# EAGLE design flute (EAGLE 6.1)
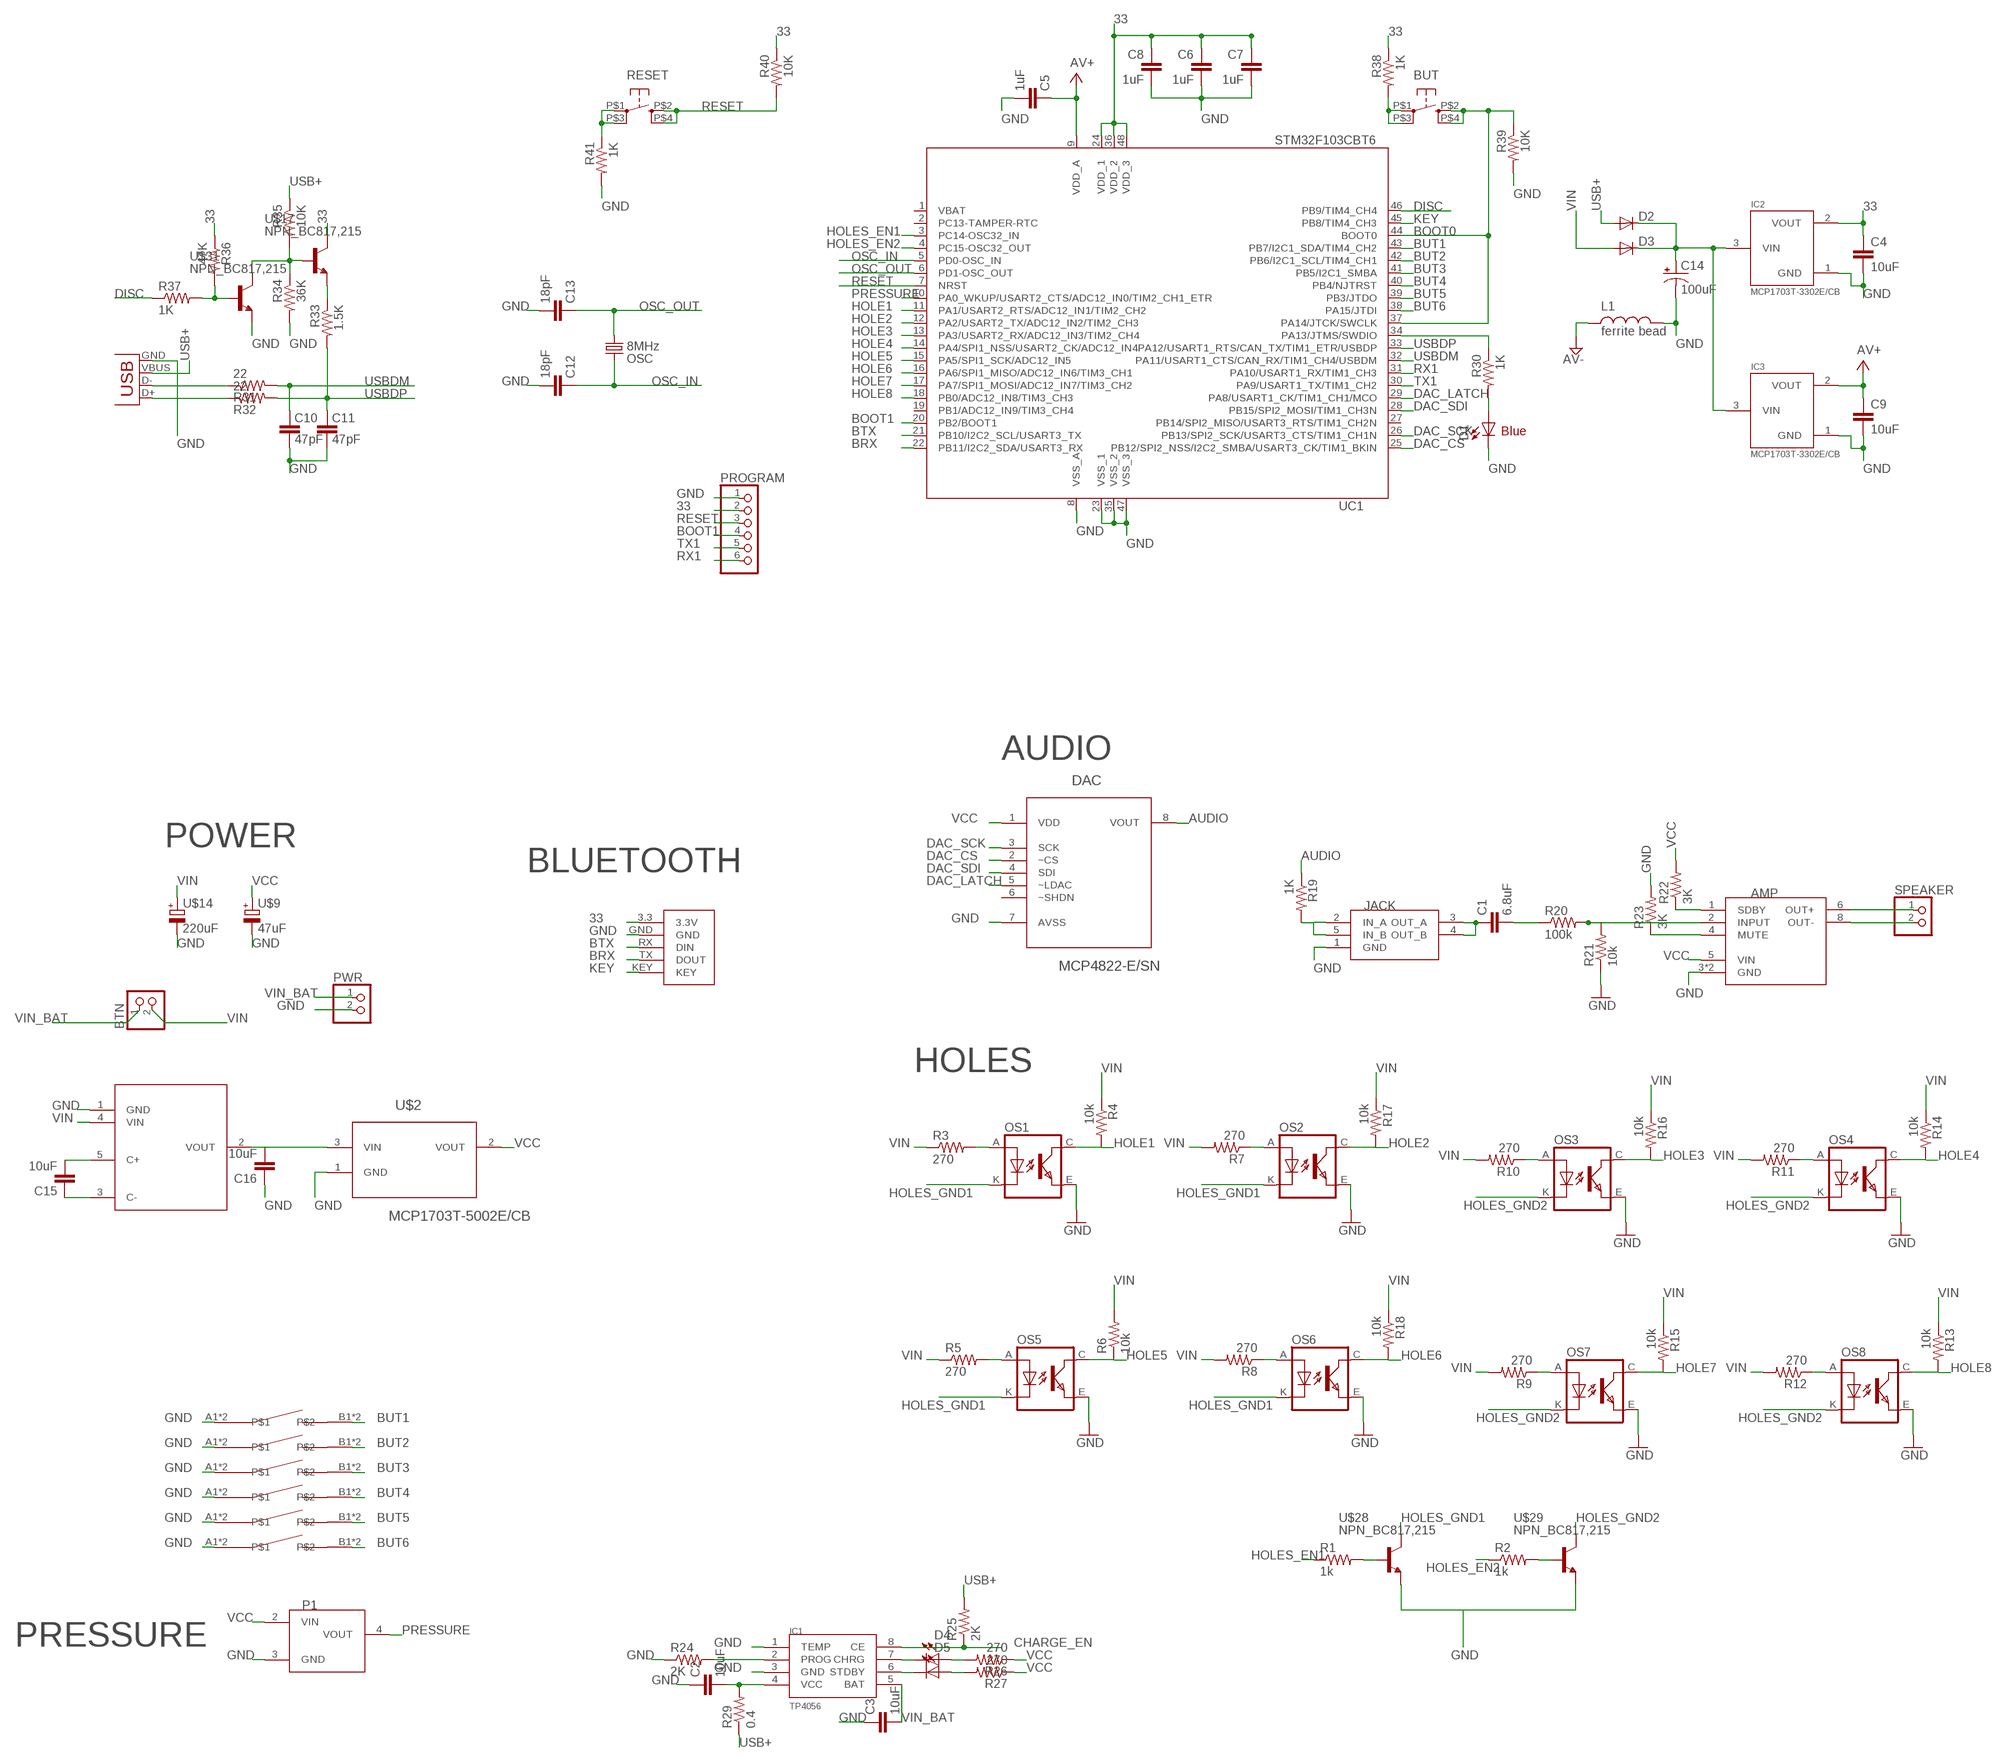
[diagram p0: schematic, sheet 1]

## Parts
AMP  AN7511DIP8  [DIL08]
BTN  CONNEC_1X02BASIC  [CONNEC_1X02]
BUT  KMR211GLFS  BUTTON-KMR241GLFS  [PUSHBUTTON-KMR241GLFS]
C1  6.8uF  CAP0805  [0805]
C2  10uF  CAP0805  [0805]
C3  10uF  CAP0805  [0805]
C4  10uF  CAP0805  [0805]
C5  1uF  CAP0402  [C0402]
C6  1uF  CAP0402  [C0402]
C7  1uF  CAP0402  [C0402]
C8  1uF  CAP0402  [C0402]
C9  10uF  CAP0805  [0805]
C10  47pF  CAP0402  [C0402]
C11  47pF  CAP0402  [C0402]
C12  18pF  CAP0402  [C0402]
C13  18pF  CAP0402  [C0402]
C14  100uF  CAP_POL1206  [EIA3216]
C15  10uF  CAP0805  [0805]
C16  10uF  CAP0805  [0805]
D1  Blue  LED1206  [LED-1206]
D2  DIODESOD  [SOD-323]
D3  DIODESOD  [SOD-323]
D4  Red  LED1206  [LED-1206]
D5  Green  LED1206  [LED-1206]
DAC  MCP4822-E/SN  [SOIC8-N_MC]
IC1  TP4056  [SOP-8]
IC2  MCP1703T-3302E/CB  MCP1700T  [SOT23]
IC3  MCP1703T-3302E/CB  MCP1700T  [SOT23]
JACK  JACK  [3F07]
L1  ferrite bead  INDUCTOR0603  [0603]
OS1  TCRT5000  [TCRT5000]
OS2  TCRT5000  [TCRT5000]
OS3  TCRT5000  [TCRT5000]
OS4  TCRT5000  [TCRT5000]
OS5  TCRT5000  [TCRT5000]
OS6  TCRT5000  [TCRT5000]
OS7  TCRT5000  [TCRT5000]
OS8  TCRT5000  [TCRT5000]
OSC  8MHz  CRYSTAL5X3  [CRYSTAL-SMD-5X3]
P1  PRESSURE_SENSOR  [MPXV5050GP]
PROGRAM  CONNEC_1X066PADS  [6PADS]
PWR  CONNEC_1X02BASIC  [CONNEC_1X02]
R1  1k  RESISTOR0805-RES  [0805]
R2  1k  RESISTOR0805-RES  [0805]
R3  270  RESISTOR0805-RES  [0805]
R4  10k  RESISTOR0805-RES  [0805]
R5  270  RESISTOR0805-RES  [0805]
R6  10k  RESISTOR0805-RES  [0805]
R7  270  RESISTOR0805-RES  [0805]
R8  270  RESISTOR0805-RES  [0805]
R9  270  RESISTOR0805-RES  [0805]
R10  270  RESISTOR0805-RES  [0805]
R11  270  RESISTOR0805-RES  [0805]
R12  270  RESISTOR0805-RES  [0805]
R13  10k  RESISTOR0805-RES  [0805]
R14  10k  RESISTOR0805-RES  [0805]
R15  10k  RESISTOR0805-RES  [0805]
R16  10k  RESISTOR0805-RES  [0805]
R17  10k  RESISTOR0805-RES  [0805]
R18  10k  RESISTOR0805-RES  [0805]
R19  1K  RESISTOR0805-RES  [0805]
R20  100k  RESISTOR0805-RES  [0805]
R21  10k  RESISTOR0805-RES  [0805]
R22  3K  RESISTOR0805-RES  [0805]
R23  3K  RESISTOR0805-RES  [0805]
R24  2K  RESISTOR0805-RES  [0805]
R25  2K  RESISTOR0805-RES  [0805]
R26  270  RESISTOR0805-RES  [0805]
R27  270  RESISTOR0805-RES  [0805]
R29  0.4  RESISTOR0805-RES  [0805]
R30  1K  RESISTOR0805-RES  [0805]
R31  22  RESISTOR0805-RES  [0805]
R32  22  RESISTOR0805-RES  [0805]
R33  1.5K  RESISTOR0805-RES  [0805]
R34  36K  RESISTOR0805-RES  [0805]
R35  10K  RESISTOR0805-RES  [0805]
R36  47K  RESISTOR0805-RES  [0805]
R37  1K  RESISTOR0805-RES  [0805]
R38  1K  RESISTOR0805-RES  [0805]
R39  10K  RESISTOR0805-RES  [0805]
R40  10K  RESISTOR0805-RES  [0805]
R41  1K  RESISTOR0805-RES  [0805]
RESET  KMR211GLFS  BUTTON-KMR241GLFS  [PUSHBUTTON-KMR241GLFS]
SPEAKER  CONNEC_1X02BASIC  [CONNEC_1X02]
U$1  MAX1683  [SOT23-5]
U$2  MCP1703T-5002E/CB  [SOT95P300X145-3N]
U$9  47uF  CPOL_EUPANASONIC_D  [PANASONIC_D]
U$14  220uF  CPOL_EUPANASONIC_D8  [PANASONIC_D8]
U$17  NPN_BC817,215  [SOT-23]
U$18  SWITCH6X6X10  [SWITCH_6X6X10]
U$19  SWITCH6X6X10  [SWITCH_6X6X10]
U$20  SWITCH6X6X10  [SWITCH_6X6X10]
U$21  SWITCH6X6X10  [SWITCH_6X6X10]
U$22  SWITCH6X6X10  [SWITCH_6X6X10]
U$23  SWITCH6X6X10  [SWITCH_6X6X10]
U$24  HC05  [HC-05]
U$28  NPN_BC817,215  [SOT-23]
U$29  NPN_BC817,215  [SOT-23]
U$31  NPN_BC817,215  [SOT-23]
UC1  STM32F103CBT6  STM32F103CB  [LQFP48]
X1  USB-MINIB  USBSMD  [USB-MINIB]

## Nets
32: BUT.P$2 BUT.P$4 R39.1 UC1.37(PA14/JTCK/SWCLK) UC1.44(BOOT0)
33: C4.1 C6.1 C7.1 C8.1 IC2.2(VOUT) PROGRAM.2 R36.1 R38.1 R40.1 U$17.3(C) U$24.3.3(3.3V) UC1.24(VDD_1) UC1.36(VDD_2) UC1.48(VDD_3)
AUDIO: DAC.8(VOUT) R19.1
AV+: C5.1 C9.1 IC3.2(VOUT) UC1.9(VDD_A)
AV-: L1.1
BOOT1: PROGRAM.4 UC1.20(PB2/BOOT1)
BRX: U$24.TX(DOUT) UC1.22(PB11/I2C2_SDA/USART3_RX)
BTX: U$24.RX(DIN) UC1.21(PB10/I2C2_SCL/USART3_TX)
BUT1: U$18.B1 U$18.B2 UC1.43(PB7/I2C1_SDA/TIM4_CH2)
BUT2: U$19.B1 U$19.B2 UC1.42(PB6/I2C1_SCL/TIM4_CH1)
BUT3: U$20.B1 U$20.B2 UC1.41(PB5/I2C1_SMBA)
BUT4: U$21.B1 U$21.B2 UC1.40(PB4/NJTRST)
BUT5: U$22.B1 U$22.B2 UC1.39(PB3/JTDO)
BUT6: U$23.B1 U$23.B2 UC1.38(PA15/JTDI)
CHARGE_EN: IC1.8(CE) R25.1
DAC_CS: DAC.2(~CS) UC1.25(PB12/SPI2_NSS/I2C2_SMBA/USART3_CK/TIM1_BKIN)
DAC_LATCH: DAC.5(~LDAC) UC1.29(PA8/USART1_CK/TIM1_CH1/MCO)
DAC_SCK: DAC.3(SCK) UC1.26(PB13/SPI2_SCK/USART3_CTS/TIM1_CH1N)
DAC_SDI: DAC.4(SDI) UC1.28(PB15/SPI2_MOSI/TIM1_CH3N)
DISC: R37.1 UC1.46(PB9/TIM4_CH4)
GND [alim]: AMP.3(GND) AMP.7(GND) C2.1 C3.1 C4.2 C5.2 C6.2 C7.2 C8.2 C9.2 C10.1 C11.1 C12.2 C13.2 C14.C(-) C16.1 D1.C DAC.7(AVSS) IC1.1(TEMP) IC1.3(GND) IC2.1(GND) IC3.1(GND) JACK.1(GND) L1.2 OS1.E(EMITTER) OS2.E(EMITTER) OS3.E(EMITTER) OS4.E(EMITTER) OS5.E(EMITTER) OS6.E(EMITTER) OS7.E(EMITTER) OS8.E(EMITTER) P1.3(GND) PROGRAM.1 PWR.2 R21.1 R23.2 R24.1 R34.2 R39.2 R41.2 U$1.1(GND) U$2.1(GND) U$9.- U$14.- U$18.A1 U$18.A2 U$19.A1 U$19.A2 U$20.A1 U$20.A2 U$21.A1 U$21.A2 U$22.A1 U$22.A2 U$23.A1 U$23.A2 U$24.GND U$28.2(E) U$29.2(E) U$31.2(E) UC1.8(VSS_A) UC1.23(VSS_1) UC1.35(VSS_2) UC1.47(VSS_3) X1.GND
HOLE1: OS1.C(COLLECTOR) R4.2 UC1.11(PA1/USART2_RTS/ADC12_IN1/TIM2_CH2)
HOLE2: OS2.C(COLLECTOR) R17.2 UC1.12(PA2/USART2_TX/ADC12_IN2/TIM2_CH3)
HOLE3: OS3.C(COLLECTOR) R16.2 UC1.13(PA3/USART2_RX/ADC12_IN3/TIM2_CH4)
HOLE4: OS4.C(COLLECTOR) R14.2 UC1.14(PA4/SPI1_NSS/USART2_CK/ADC12_IN4)
HOLE5: OS5.C(COLLECTOR) R6.1 UC1.15(PA5/SPI1_SCK/ADC12_IN5)
HOLE6: OS6.C(COLLECTOR) R18.2 UC1.16(PA6/SPI1_MISO/ADC12_IN6/TIM3_CH1)
HOLE7: OS7.C(COLLECTOR) R15.2 UC1.17(PA7/SPI1_MOSI/ADC12_IN7/TIM3_CH2)
HOLE8: OS8.C(COLLECTOR) R13.2 UC1.18(PB0/ADC12_IN8/TIM3_CH3)
HOLES_EN1: R1.1 UC1.3(PC14-OSC32_IN)
HOLES_EN2: R2.1 UC1.4(PC15-OSC32_OUT)
HOLES_GND1: OS1.K(CATHODE) OS2.K(CATHODE) OS5.K(CATHODE) OS6.K(CATHODE) U$28.3(C)
HOLES_GND2: OS3.K(CATHODE) OS4.K(CATHODE) OS7.K(CATHODE) OS8.K(CATHODE) U$29.3(C)
KEY: U$24.KEY UC1.45(PB8/TIM4_CH3)
N$1 [alim]: AMP.6(OUT+) SPEAKER.1
N$2 [alim]: AMP.8(OUT-) SPEAKER.2
N$3: R1.2 U$28.1(B)
N$4: R2.2 U$29.1(B)
N$5: OS1.A(ANODE) R3.2
N$6: D5.A R27.2
N$7: OS2.A(ANODE) R7.1
N$8: JACK.2(IN_A) JACK.5(IN_B) R19.2
N$9: OS3.A(ANODE) R10.1
N$10: AMP.4(MUTE) R23.1
N$11: OS4.A(ANODE) R11.1
N$12: C1.2 R20.1
N$13: OS5.A(ANODE) R5.2
N$14: AMP.1(SDBY) R22.1
N$15: OS6.A(ANODE) R8.1
N$16: D4.A R26.2
N$17: OS7.A(ANODE) R9.1
N$18: AMP.2(INPUT) R20.2 R21.2
N$19: OS8.A(ANODE) R12.1
N$20: C1.1 JACK.3(OUT_A) JACK.4(OUT_B)
N$21: IC1.2(PROG) R24.2
N$22: C15.1 U$1.3(C-)
N$23: C2.2 IC1.4(VCC) R29.2
N$24: D4.C IC1.7(CHRG)
N$25: D5.C IC1.6(STDBY)
N$26: BUT.P$1 BUT.P$3 R38.2
N$27: R41.1 RESET.P$1 RESET.P$3
N$28: D1.A R30.2
N$29: R30.1 UC1.34(PA13/JTMS/SWDIO)
N$30: C15.2 U$1.5(C+)
N$31: C16.2 U$1.2(VOUT) U$2.3(VIN)
N$51: R33.1 U$17.2(E)
N$59: R31.1 X1.D-
N$60: R32.1 X1.D+
N$71: R34.1 R35.2 U$17.1(B) U$31.3(C)
N$73: R36.2 R37.2 U$31.1(B)
OSC_IN: C12.1 OSC.3 UC1.5(PD0-OSC_IN)
OSC_OUT: C13.1 OSC.1 UC1.6(PD1-OSC_OUT)
PRESSURE: P1.4(VOUT) UC1.10(PA0_WKUP/USART2_CTS/ADC12_IN0/TIM2_CH1_ETR)
RESET: PROGRAM.3 R40.2 RESET.P$2 RESET.P$4 UC1.7(NRST)
RX1: PROGRAM.6 UC1.31(PA10/USART1_RX/TIM1_CH3)
TX1: PROGRAM.5 UC1.30(PA9/USART1_TX/TIM1_CH2)
USB+: D2.2(A) R25.2 R29.1 R35.1 X1.VBUS
USBDM: C10.2 R31.2 UC1.32(PA11/USART1_CTS/CAN_RX/TIM1_CH4/USBDM)
USBDP: C11.2 R32.2 R33.2 UC1.33(PA12/USART1_RTS/CAN_TX/TIM1_ETR/USBDP)
VCC [alim]: AMP.5(VIN) DAC.1(VDD) P1.2(VIN) R22.2 R26.1 R27.1 U$2.2(VOUT) U$9.+
VIN [alim]: BTN.2 D3.2(A) R3.1 R4.1 R5.1 R6.2 R7.2 R8.2 R9.2 R10.2 R11.2 R12.2 R13.1 R14.1 R15.1 R16.1 R17.1 R18.1 U$1.4(VIN) U$14.+
VIN_BAT [alim]: BTN.1 C3.2 IC1.5(BAT) PWR.1
VIN_REGS [alim]: C14.A(+) D2.1(C) D3.1(C) IC2.3(VIN) IC3.3(VIN)
Unconnected: DAC.6(~SHDN) UC1.2(PC13-TAMPER-RTC) UC1.19(PB1/ADC12_IN9/TIM3_CH4) UC1.27(PB14/SPI2_MISO/USART3_RTS/TIM1_CH2N)

## Notes on the sheet
- BOOT0
- Blue
- AUDIO
- POWER
- BLUETOOTH
- HOLES
- PRESSURE

## Power pins joined to a net without a drawn wire
VBAT: UC1.1(VBAT)

## Library data of the parts
AMP = rhoban:AN7511
BTN PWR SPEAKER = rhoban:CONNEC_1X02
BUT RESET = okie:BUTTON-KMR241GLFS
C1-C3 C15 C16 = SparkFun-Passives:CAP: Capacitor Standard 0603 ceramic capacitor, and 0.1" leaded capacitor.
C4 C9 = SparkFun2:CAP: Capacitor Standard 0603 ceramic capacitor, and 0.1" leaded capacitor.
C5-C8 C10-C13 = SparkFun:CAP: Capacitor Standard 0603 ceramic capacitor, and 0.1" leaded capacitor.
C14 = SparkFun3:CAP_POL: Capacitor Polarized These are standard SMD and PTH capacitors. Normally 10uF, 47uF, and 100uF in electrolytic and tantalum varieties. Always verify the external diameter of the through hole cap, it varies with capacity, voltage, and manufacturer. The EIA devices should be standard.
D1 D4 D5 = SparkFun:LED: LEDs Standard schematic elements and footprints for 5mm, 3mm, 1206, and 0603 sized LEDs. 5mm - Spark Fun Electronics SKU : COM-00529 (and others)
D2 D3 = SparkFun3:DIODE: Diode These are standard reverse protection diodes and small signal diodes. SMA package can handle up to about 1A. SOD-323 can handle about 200mA. What the SOD-323 package when ordering, there are some mfgs out there that are 5-pin packages.
DAC = rhoban:MCP4822-E/SN: 12 Bit DAC; DESCRIPTION: 12 Bit DAC; MPN: MCP4822-E/SN; OC_FARNELL: 1439414; OC_NEWARK: 31K2975; PACKAGE: SOIC-8; SUPPLIER: Microchip
IC1 = TP4056:TP4056
IC2 IC3 = okie:MCP1700T
JACK = rhoban:JACK
L1 = SparkFun3:INDUCTOR: Inductors Basic Inductor/Choke - 0603 and 1206. Footprints are not proven and vary greatly between part numbers.
OS1-OS8 = tcrt5000:TCRT5000
OSC = SparkFun2:CRYSTAL: Crystals Various standard crystals. Proven footprints. Spark Fun Electronics SKU : COM-00534
P1 = rhoban:PRESSURE_SENSOR
PROGRAM = rhoban:CONNEC_1X06
R1-R27 R29-R41 = SparkFun-Passives:RESISTOR: Resistor Basic schematic elements and footprints for 0603, 1206, and PTH resistors.
U$1 = rhoban:MAX1683
U$2 = rhoban:MCP1703T-5002E/CB: Low Quiescent Current LDO Regulator; MPN: MCP1703T-5002E/CB; OC_FARNELL: 1439519; OC_NEWARK: 40M0640; PACKAGE: SOT-3; SUPPLIER: Microchip
U$9 U$14 = rhoban:CPOL_EU: 47uF: http://fr.farnell.com/panasonic-electronic-components/eee1ca470sp/condensateur-elec-alu-47uf-16v/dp/9696946 220uF: http://fr.farnell.com/panasonic-electronic-components/eeefk1c221xp/condensateur-elec-alu-220uf-16v/dp/1850103
U$17 U$28 U$29 U$31 = rhoban:NPN
U$18-U$23 = rhoban:SWITCH
U$24 = rhoban:HC05
UC1 = stm32:STM32F103CB
X1 = SparkFun2:USB: USB Connectors USB-B-PTH is fully proven SKU : PRT-00139 USB-miniB is fully proven SKU : PRT-00587 USB-A-PCB is untested. USB-A-H is throughly reviewed, but untested. Spark Fun Electronics SKU : PRT-00437 USB-B-SMT is throughly reviewed, but untested. Needs silkscreen touching up. USB-A-S has not been used/tested USB-MB-H has not been used/tested

## Net classes
1 alim: width 0.381 mm, clearance 0.076 mm

## Board
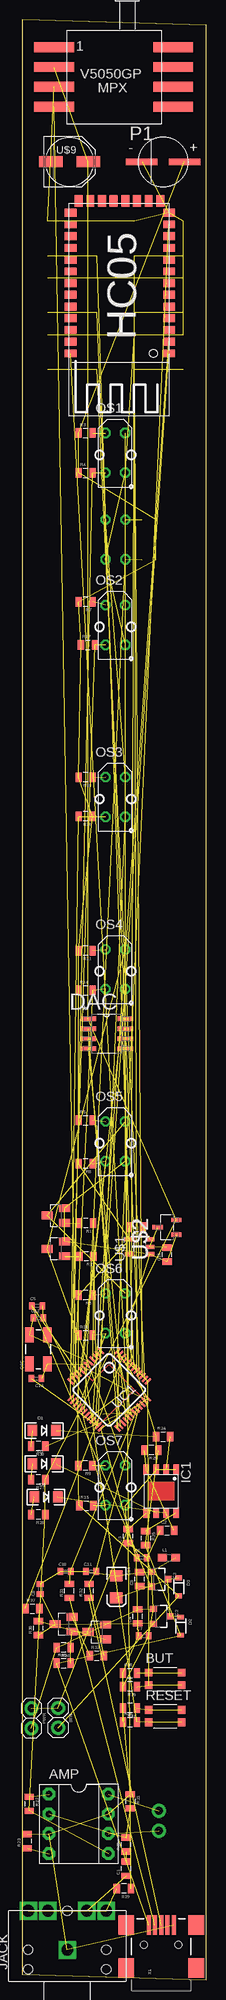
[diagram p1: board, top side]
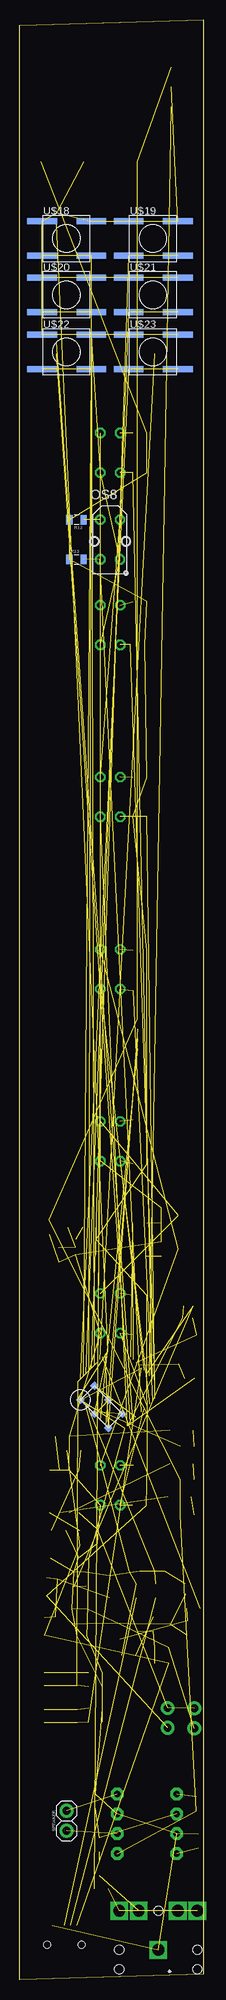
[diagram p2: board, bottom side, seen from below]

Size 23.55 x 250.7 mm. Coordinates in mm from the lower left corner, seen from the top.
Outline: 0,0.7 23.55,0 23.55,250 0,250.7 0,0.7
Copper layers (1*16): Top 0.035mm / dielectric 1.5mm / Bottom 0.035mm
Design rules: minimum track width 6mil, minimum drill 0.3mm, track to track 0.205mm, track to pad 0.205mm, pad to pad 0.205mm, via to via 0.205mm, smd to smd 8mil, copper to edge 40mil, drill to drill 8mil, minimum pad ring 10mil, minimum via ring 8mil, stop-mask expansion 4mil, vias tented up to drill 25mil, thermal gap 10mil

### Footprints (pad centres in the part's own frame; a part is rotated, then mirrored left to right if it is on the bottom)
DIL08 = drill 0.813 pad 1.6 octagon: 1 -3.81,-3.81; 2 -1.27,-3.81; 3 1.27,-3.81; 4 3.81,-3.81; 5 3.81,3.81; 6 1.27,3.81; 7 -1.27,3.81; 8 -3.81,3.81
CONNEC_1X02 = drill 1 pad 1.778: 1 -1.27,1.27; 2 1.27,1.27
PUSHBUTTON-KMR241GLFS = smd 1 x 1: P$1 2.1,0.8; P$2 2.1,-0.8; P$3 -2.1,0.8; P$4 -2.1,-0.8
0805 = smd 0.8 x 1.2: 1 -0.9,0; 2 0.9,0
C0402 = smd 0.7 x 0.9: 1 -0.65,0; 2 0.65,0
EIA3216 = smd 1.4 x 1.6: A 1.4,0; C -1.4,0
LED-1206 = smd 1.2 x 1.4: A -1.5,0; C 1.5,0
SOD-323 = smd 0.63 x 0.83: 1 -1.15,0; 2 1.15,0
SOIC8-N_MC = smd 1.981 x 0.559: 1 -2.362,1.905; 2 -2.362,0.635; 3 -2.362,-0.635; 4 -2.362,-1.905; 5 2.362,-1.905; 6 2.362,-0.635; 7 2.362,0.635; 8 2.362,1.905
SOP-8 = smd 1.3 x 0.7: 1 -2.75,1.905; 2 -2.75,0.635; 3 -2.75,-0.635; 4 -2.75,-1.905; 5 2.75,-1.905; 6 2.75,-0.635; 7 2.75,0.635; 8 2.75,1.905
SOT23 = smd 0.8 x 0.9: 1 -0.95,-1; 2 0.95,-1; 3 0,1.1
3F07 = drill 1.5 square: 1 0,0; 2 5,5; 3 5,2.5; 4 5,-2.5; 5 5,-5 | hole 1.2: 5,0; 0,-5; -2.5,-5; -2.5,5; 0,5
0603 = smd 1.1 x 1: 1 -0.85,0; 2 0.85,0
TCRT5000 = drill 0.8 octagon: A -2.54,-1.27; C 2.54,-1.27; E 2.54,1.27; K -2.54,1.27
CRYSTAL-SMD-5X3 = smd 1.9 x 1.1: 1 -1.85,-1.15; 2 1.85,-1.15; 3 1.85,1.15; 4 -1.85,1.15
MPXV5050GP = smd 5.08 x 1.27: 1 15.24,0; 2 15.24,2.54; 3 15.24,5.08; 4 15.24,7.62; 5 0,7.62; 6 0,5.08; 7 0,2.54; 8 0,0
6PADS = smd 0.762 x 0.762: 1 0,0; 2 0,2.54; 3 0,5.08; 4 2.54,5.08; 5 2.54,2.54; 6 2.54,0
SOT23-5 = smd 0.55 x 1.2: 1 -0.95,-1.3; 2 0,-1.3; 3 0.95,-1.3; 4 0.95,1.3; 5 -0.95,1.3
SOT95P300X145-3N = smd 0.559 x 1.321: 1 -0.94,-1.194; 2 0.94,-1.194; 3 0,1.194
PANASONIC_D = smd 3 x 1.4: + 2.4,0; - -2.4,0
PANASONIC_D8 = smd 4.016 x 0.8: + 2.73,0; - -2.73,0
SOT-23 = smd 1 x 1.4: 1 -0.95,-1.1; 2 0.95,-1.1; 3 0,1.1
SWITCH_6X6X10 = smd 3.81 x 0.75: A1 -0.1,5.2; A2 6.2,5.2; B1 -0.1,0.8; B2 6.2,0.8
HC-05 = smd 1.5 x 1: 3.3 0,-16.5; GND 0,-18; KEY 12.6,0; P$3 0,-3; P$4 0,-4.5; P$5 0,-6; P$6 0,-7.5; P$7 0,-9; P$8 0,-10.5; P$9 0,-12; P$10 0,-13.5; P$11 0,-15; P$23 12.6,-1.5; P$24 12.6,-3; P$25 12.6,-4.5; P$26 12.6,-6; P$27 12.6,-7.5; P$28 12.6,-9; P$29 12.6,-10.5; P$30 12.6,-12; P$31 12.6,-13.5; P$32 12.6,-15; P$33 12.6,-16.5; P$34 12.6,-18; RX 0,-1.5; TX 0,0 | smd 1 x 1.5: P$14 1.1,-19.5; P$15 2.6,-19.5; P$16 4.1,-19.5; P$17 5.6,-19.5; P$18 7.1,-19.5; P$19 8.6,-19.5; P$20 10.1,-19.5; P$21 11.6,-19.5
LQFP48 = smd 0.254 x 1: 1 -2.75,-4.25; 2 -2.25,-4.25; 3 -1.75,-4.25; 4 -1.25,-4.25; 5 -0.75,-4.25; 6 -0.25,-4.25; 7 0.25,-4.25; 8 0.75,-4.25; 9 1.25,-4.25; 10 1.75,-4.25; 11 2.25,-4.25; 12 2.75,-4.25; 25 2.75,4.25; 26 2.25,4.25; 27 1.75,4.25; 28 1.25,4.25; 29 0.75,4.25; 30 0.25,4.25; 31 -0.25,4.25; 32 -0.75,4.25; 33 -1.25,4.25; 34 -1.75,4.25; 35 -2.25,4.25; 36 -2.75,4.25 | smd 1 x 0.254: 13 4.25,-2.75; 14 4.25,-2.25; 15 4.25,-1.75; 16 4.25,-1.25; 17 4.25,-0.75; 18 4.25,-0.25; 19 4.25,0.25; 20 4.25,0.75; 21 4.25,1.25; 22 4.25,1.75; 23 4.25,2.25; 24 4.25,2.75; 37 -4.25,2.75; 38 -4.25,2.25; 39 -4.25,1.75; 40 -4.25,1.25; 41 -4.25,0.75; 42 -4.25,0.25; 43 -4.25,-0.25; 44 -4.25,-0.75; 45 -4.25,-1.25; 46 -4.25,-1.75; 47 -4.25,-2.25; 48 -4.25,-2.75
USB-MINIB = smd 2.5 x 0.5: D+ 2.5,0; D- 2.5,0.8; GND 2.5,-1.6; ID 2.5,-0.8; VBUS 2.5,1.6 | smd 2.5 x 2: GND@1 -3,-4.5; GND@2 -3,4.5; GND@3 2.5,4.5; GND@4 2.5,-4.5 | hole 0.9: 0,2.2; 0,-2.2

### Placement (x,y rotation side)
AMP  7.22,19.96 270 top
BTN  3.3,33.5 270 top
BUT  18.3,38.5 0 top
C1  13.32,14.23 90 top
C2  18.55,57.5 0 top
C3  13.55,56.75 90 top
C4  14.8,46.5 90 top
C5  1.9,86.2 0 top
C6  15.3,54 0 top
C7  15.55,44 0 top
C8  2.3,50 90 top
C9  15.05,51.25 90 top
C10  5.55,52.25 0 top
C11  8.8,52.25 0 top
C12  2.05,84.65 0 top
C13  1.8,76.9 180 top
C14  12.05,50.25 270 top
C15  14.55,96.25 180 top
C16  18.55,92.75 90 top
D1  2.8,70.25 0 top
D2  20.3,45.25 270 top
D3  20.05,50.25 270 top
D4  3.05,61.75 0 top
D5  2.8,66 0 top
DAC  10.8,121 0 top
IC1  17.8,62.5 270 top
IC2  17.8,46.5 270 top
IC3  17.55,51.25 270 top
JACK  5.77,3.85 90 top
L1  18.8,54 0 top
OS1  11.92,195.29 270 top
OS2  11.92,173.29 270 top
OS3  11.92,151.29 270 top
OS4  11.92,129.25 270 top
OS5  11.92,107.25 270 top
OS6  11.92,85.25 270 top
OS7  11.92,63.25 270 top
OS8  11.94,184.22 270 bottom
OSC  2.05,80.65 90 top
P1  19.33,247.17 180 top
PROGRAM  12.16,70.59 45 bottom
PWR  -0.11,33.47 270 top
R1  8.15,96.77 180 top
R2  8.2,92.53 180 top
R3  8.11,197.83 0 top
R4  8.11,192.75 0 top
R5  8.11,109.96 0 top
R6  8.11,104.38 180 top
R7  8.11,176.24 180 top
R8  8.11,87.56 180 top
R9  8.06,65.77 180 top
R10  8.11,153.78 180 top
R11  8.11,131.63 180 top
R12  16.25,186.74 180 bottom
R13  16.25,181.66 0 bottom
R14  8.11,126.55 0 top
R15  8.19,60.68 0 top
R16  8.11,148.8 180 top
R17  8.41,170.76 0 top
R18  8.11,82.48 0 top
R19  13.01,11.67 180 top
R20  13.32,17.31 90 top
R21  13.83,22.85 270 top
R22  0.88,22.52 270 top
R23  0.62,17.75 90 top
R24  18.05,69.5 0 top
R25  15.8,56.5 270 top
R26  2.05,59.5 180 top
R27  2.05,64 180 top
R29  16.55,67.75 180 top
R30  2.05,68.25 180 top
R31  6.05,49.75 90 top
R32  8.55,49.75 90 top
R33  9.55,41.5 0 top
R34  5.3,42.5 180 top
R35  5.3,40.5 0 top
R36  2.05,45 90 top
R37  1.3,47.5 0 top
R38  13.8,39.25 0 top
R39  13.8,37.5 180 top
R40  13.8,33 0 top
R41  13.8,34.75 180 top
RESET  18.3,33.75 0 top
SPEAKER  16.24,20.35 90 bottom
U$1  15.05,93.75 90 top
U$2  18.55,96.25 90 top
U$9  6.05,232.5 0 top
U$14  18.05,232.5 0 top
U$17  5.3,45.5 90 top
U$18  20.55,219.7 0 bottom
U$19  9.45,219.7 0 bottom
U$20  20.55,212.5 0 bottom
U$21  9.45,212.5 0 bottom
U$22  20.55,205.2 0 bottom
U$23  9.45,205.2 0 bottom
U$24  18.8,208 180 top
U$28  4.3,97.75 90 top
U$29  4.3,93.5 90 top
U$31  9.55,44.5 90 top
UC1  11.13,75.46 225 top
X1  17.8,4.5 90 top

### Tracks (layer width: path | path; a pad name or v marks a point on that pad's centre or on a via)
32  (4 unrouted)
33  (13 unrouted)
AUDIO  (1 unrouted)
AV+  (3 unrouted)
BOOT1  (1 unrouted)
BRX  (1 unrouted)
BTX  (1 unrouted)
BUT1  (2 unrouted)
BUT2  (2 unrouted)
BUT3  (2 unrouted)
BUT4  (2 unrouted)
BUT5  (2 unrouted)
BUT6  (2 unrouted)
CHARGE_EN  (1 unrouted)
DAC_CS  (1 unrouted)
DAC_LATCH  (1 unrouted)
DAC_SCK  (1 unrouted)
DAC_SDI  (1 unrouted)
DISC  (1 unrouted)
GND  (62 unrouted)
  Top 0.152: UC1.35 15.75,74.07 14.35,75.47 | 14.35,75.47 9.73,70.85 UC1.23 | UC1.47 11.15,78.67 | 11.15,78.67 14.35,75.47 | UC1.8 7.62,77.96 8.98,76.6 11.1,78.72 11.15,78.67
HOLE1  (2 unrouted)
HOLE2  (2 unrouted)
HOLE3  (2 unrouted)
HOLE4  (2 unrouted)
HOLE5  (2 unrouted)
HOLE6  (2 unrouted)
HOLE7  (2 unrouted)
HOLE8  (2 unrouted)
HOLES_EN1  (1 unrouted)
HOLES_EN2  (1 unrouted)
HOLES_GND1  (4 unrouted)
HOLES_GND2  (4 unrouted)
KEY  (1 unrouted)
N$1  (1 unrouted)
N$2  (1 unrouted)
N$3  (1 unrouted)
N$4  (1 unrouted)
N$5  (1 unrouted)
N$6  (1 unrouted)
N$7  (1 unrouted)
N$8  (2 unrouted)
N$9  (1 unrouted)
N$10  (1 unrouted)
N$11  (1 unrouted)
N$12  (1 unrouted)
N$13  (1 unrouted)
N$14  (1 unrouted)
N$15  (1 unrouted)
N$16  (1 unrouted)
N$17  (1 unrouted)
N$18  (2 unrouted)
N$19  (1 unrouted)
N$20  (2 unrouted)
N$21  (1 unrouted)
N$22  (1 unrouted)
N$23  (2 unrouted)
N$24  (1 unrouted)
N$25  (1 unrouted)
N$26  (2 unrouted)
N$27  (2 unrouted)
N$28  (1 unrouted)
N$29  (1 unrouted)
N$30  (1 unrouted)
N$31  (2 unrouted)
N$51  (1 unrouted)
N$59  (1 unrouted)
N$60  (1 unrouted)
N$71  (3 unrouted)
N$73  (2 unrouted)
OSC_IN  (2 unrouted)
OSC_OUT  (2 unrouted)
PRESSURE  (1 unrouted)
RESET  (4 unrouted)
RX1  (1 unrouted)
TX1  (1 unrouted)
USB+  (4 unrouted)
USBDM  (2 unrouted)
USBDP  (3 unrouted)
VCC  (7 unrouted)
VIN  (19 unrouted)
VIN_BAT  (3 unrouted)
VIN_REGS  (4 unrouted)